# Altium schematic sheet circuit1_ver2.SchDoc
size A4
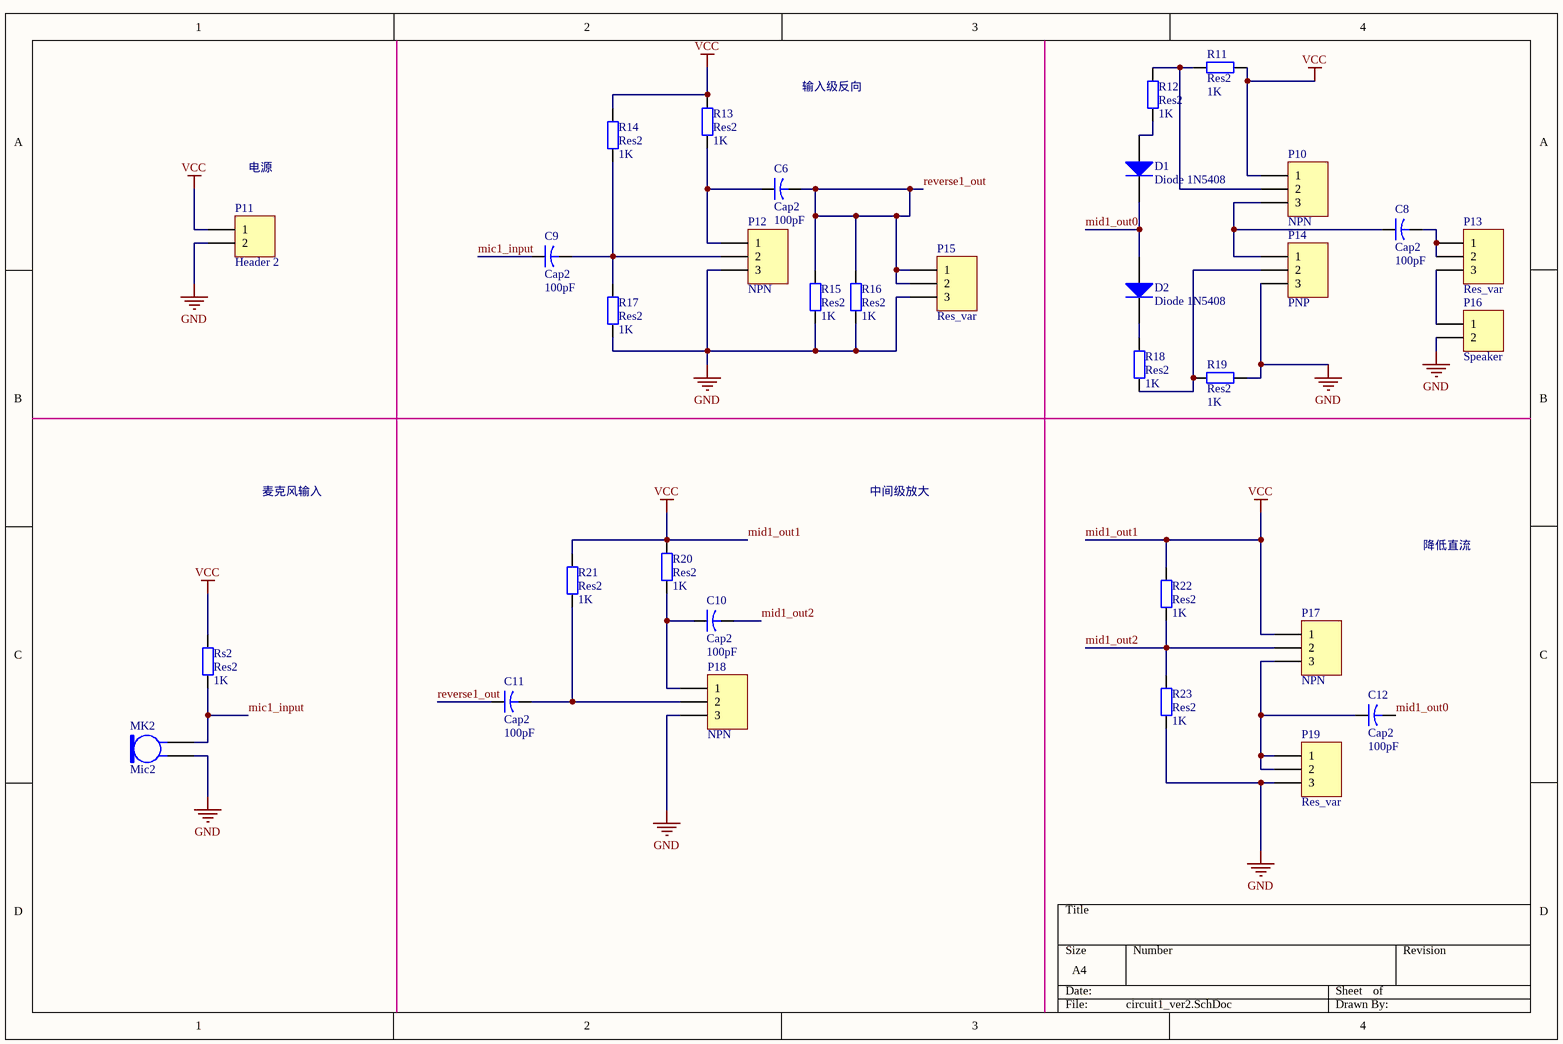
[diagram p0: circuit1_ver2.SchDoc]

## Parts
C6  Cap2  value 100pF  [CAPR5-4X5]
C8  Cap2  value 100pF  [CAPR5-4X5]
C9  Cap2  value 100pF  [CAPR5-4X5]
C10  Cap2  value 100pF  [CAPR5-4X5]
C11  Cap2  value 100pF  [CAPR5-4X5]
C12  Cap2  value 100pF  [CAPR5-4X5]
D1  Diode 1N5408  [DO-201AD]
D2  Diode 1N5408  [DO-201AD]
MK2  Mic2  [PIN2]
P10  NPN  [HDR1X3]
P11  Header 2  [HDR1X2]
P12  NPN  [HDR1X3]
P13  Res_var  [HDR1X3]
P14  PNP  [HDR1X3]
P15  Res_var  [HDR1X3]
P16  Speaker  [HDR1X2]
P17  NPN  [HDR1X3]
P18  NPN  [HDR1X3]
P19  Res_var  [HDR1X3]
R11  Res2  value 1K  [AXIAL-0.4]
R12  Res2  value 1K  [AXIAL-0.4]
R13  Res2  value 1K  [AXIAL-0.4]
R14  Res2  value 1K  [AXIAL-0.4]
R15  Res2  value 1K  [AXIAL-0.4]
R16  Res2  value 1K  [AXIAL-0.4]
R17  Res2  value 1K  [AXIAL-0.4]
R18  Res2  value 1K  [AXIAL-0.4]
R19  Res2  value 1K  [AXIAL-0.4]
R20  Res2  value 1K  [AXIAL-0.4]
R21  Res2  value 1K  [AXIAL-0.4]
R22  Res2  value 1K  [AXIAL-0.4]
R23  Res2  value 1K  [AXIAL-0.4]
Rs2  Res2  value 1K  [AXIAL-0.4]

## Nets
GND: MK2.1 P11.2 P12.3 P14.3 P15.3 P16.2 P18.3 P19.3 R15.1 R16.1 R17.1 R19.1 R23.1
mid1_out1: P10.1 P11.1 P17.1 R11.1 R13.2 R14.2 R20.2 R21.2 R22.2 Rs2.2  [also labelled VCC]
mic1_input: C9.1 MK2.2 Rs2.1
mid1_out0: C12.2 D1.2(K) D2.1(A)
mid1_out2: C10.2 P17.2 R22.1 R23.2
reverse1_out: C6.2 C11.1 P15.1 P15.2 R15.2 R16.2
NetC6_1: C6.1 P12.1 R13.1
NetC8_1: C8.1 P10.3 P14.1
NetC8_2: C8.2 P13.1 P13.2
NetC9_2: C9.2 P12.2 R14.1 R17.2
NetC10_1: C10.1 P18.1 R20.1
NetC11_2: C11.2 P18.2 R21.1
NetC12_1: C12.1 P17.3 P19.1 P19.2
NetD1_1: D1.1(A) R12.1
NetD2_2: D2.2(K) R18.2
NetP10_2: P10.2 R11.2 R12.2
NetP13_3: P13.3 P16.1
NetP14_2: P14.2 R18.1 R19.2

## Notes on the sheet
- 输入级反向
- 电源
- 麦克风输入
- 中间级放大
- 降低直流

## Library data of the parts
C6 C8-C12 = Cap2: Capacitor; Published: 23-Sep-2002; PackageReference: CAPR5-4X5; Publisher: Altium Limited; PackageDescription: Capacitor; 2 Leads
D1 D2 = Diode 1N5408: 3 Amp Medium Power Silicon Rectifier Diode; Published: 8-Jun-2000; LatestRevisionDate: 17-Jul-2002; LatestRevisionNote: Re-released for DXP Platform.; DatasheetVersion: Aug-1984; PackageReference: DO-201AD; Publisher: Altium Limited; PackageDescription: Diode, Axial; Body 9.5 x 5.3 mm (LxDia. max), Lead Dia. 1.32 mm (max); ComponentLink1Description: Manufacturer Link; ComponentLink1URL: http://www.irf.com/
MK2 = Mic2: Microphone; Published: 24-Mar-1999; LatestRevisionDate: 17-Jul-2002; LatestRevisionNote: Re-released for DXP Platform.; PackageReference: PIN2; Publisher: Altium Limited
P10 P12-P15 P17-P19 = Header 3: Header, 3-Pin; LatestRevisionDate: 17-Jul-2002; LatestRevisionNote: Re-released for DXP Platform.; Publisher: Altium Limited
P11 P16 = Header 2: Header, 2-Pin; LatestRevisionDate: 17-Jul-2002; LatestRevisionNote: Re-released for DXP Platform.; Publisher: Altium Limited
R11-R23 Rs2 = Res2: Resistor; Published: 8-Jun-2000; LatestRevisionDate: 17-Jul-2002; LatestRevisionNote: Re-released for DXP Platform.; PackageReference: AXIAL-0.4; Publisher: Altium Limited; PackageDescription: Axial Device, Thru-Hole; 2 Leads; 0.4 in Pin Spacing